# EAGLE schematic mouse_shield (EAGLE 5.11)
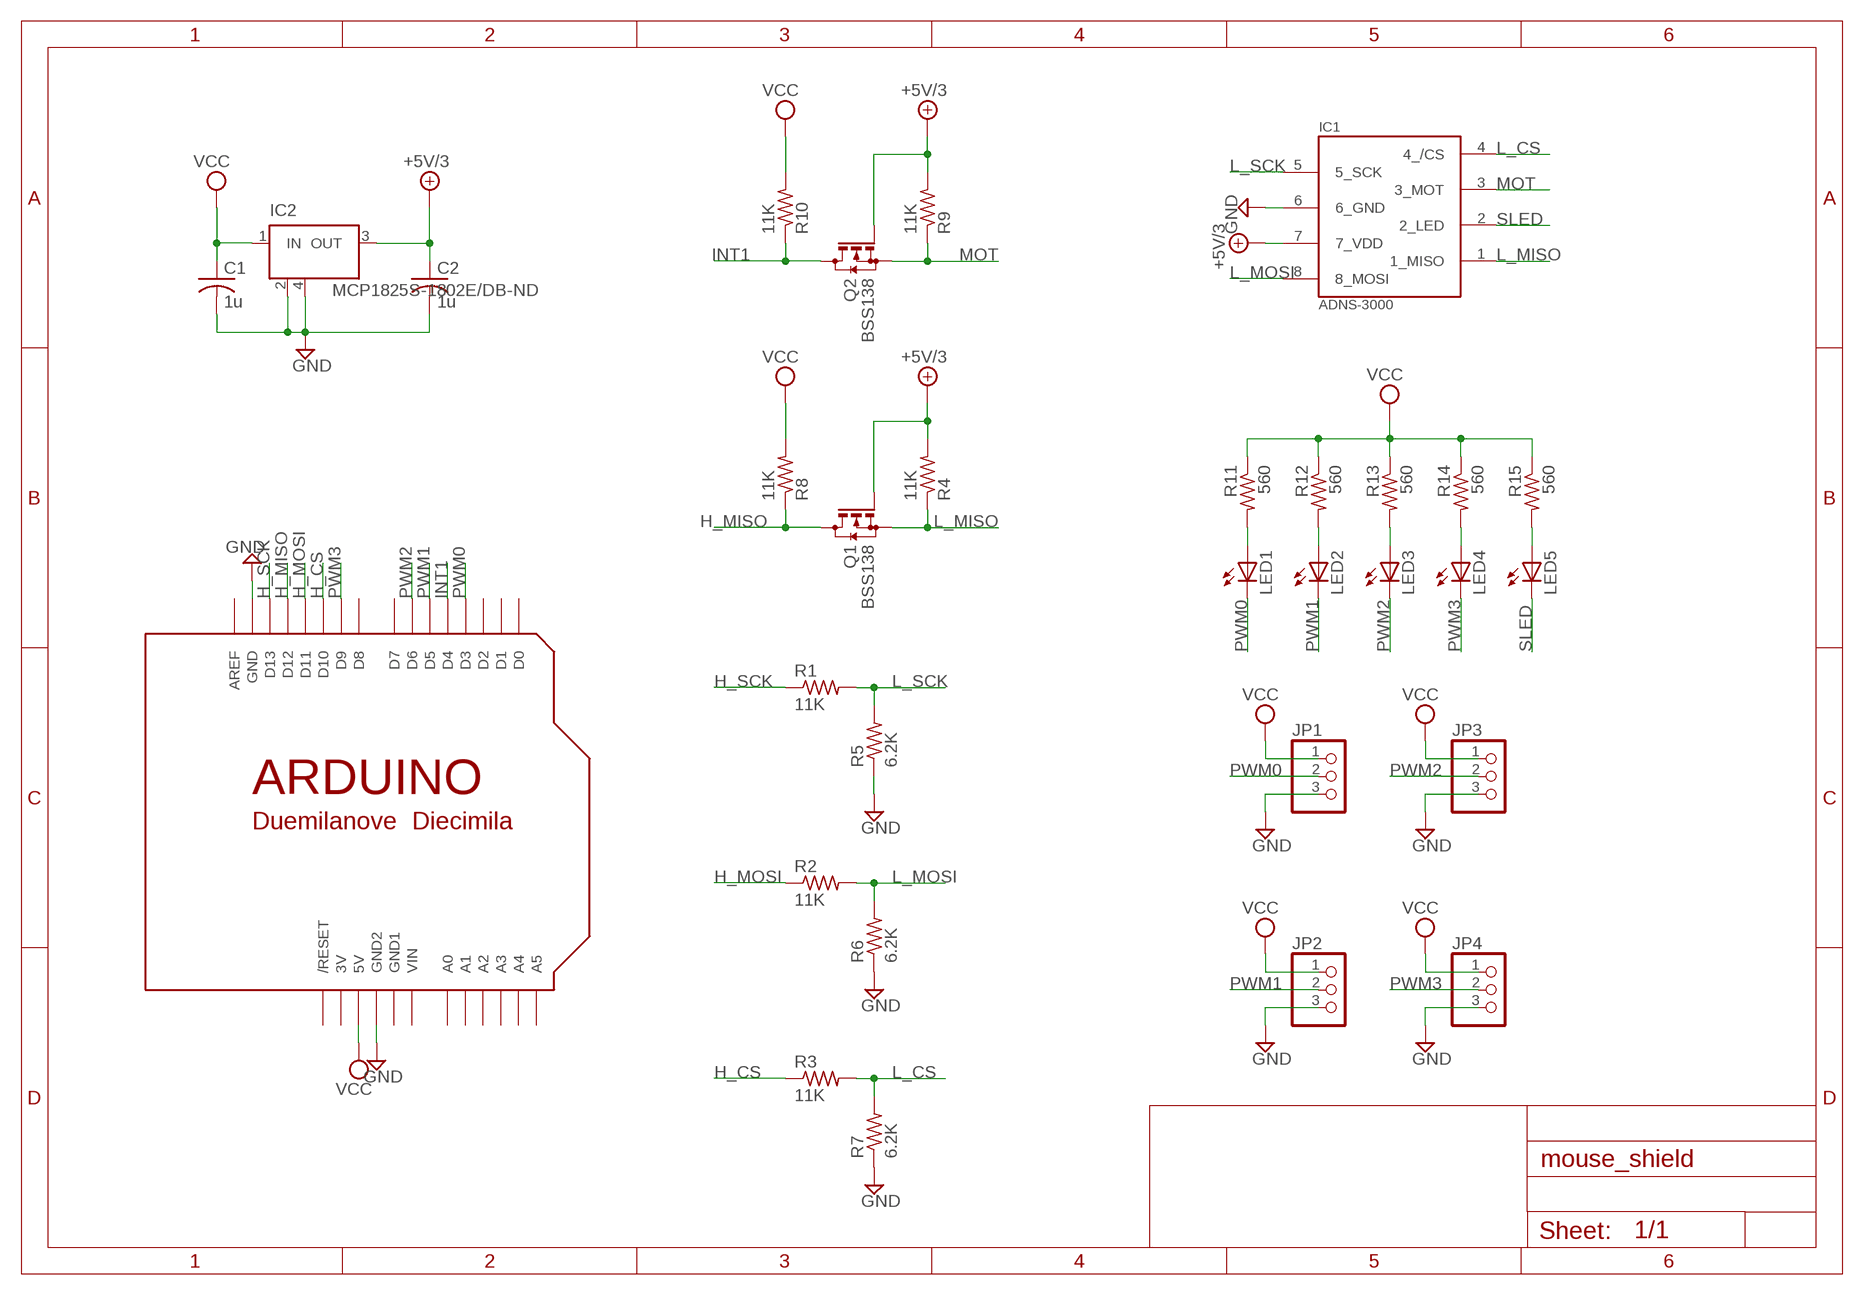
[diagram p0: schematic, sheet 1]

## Parts
C1  1u  C-USC1206  [C1206]
C2  1u  C-USC1206  [C1206]
IC1  ADNS-3000  [ADNS-3000]
IC2  MCP1825S-1802E/DB-ND  LM340S  [SOT223]
JP1  PINHD-1X3/90  [1X03/90]
JP2  PINHD-1X3/90  [1X03/90]
JP3  PINHD-1X3/90  [1X03/90]
JP4  PINHD-1X3/90  [1X03/90]
LED1  LEDCHIPLED_1206  [CHIPLED_1206]
LED2  LEDCHIPLED_1206  [CHIPLED_1206]
LED3  LEDCHIPLED_1206  [CHIPLED_1206]
LED4  LEDCHIPLED_1206  [CHIPLED_1206]
LED5  LEDCHIPLED_1206  [CHIPLED_1206]
Q1  BSS138  BSS123  [SOT23]
Q2  BSS138  BSS123  [SOT23]
R1  11K  R-US_R1206  [R1206]
R2  11K  R-US_R1206  [R1206]
R3  11K  R-US_R1206  [R1206]
R4  11K  R-US_R1206  [R1206]
R5  6.2K  R-US_R1206  [R1206]
R6  6.2K  R-US_R1206  [R1206]
R7  6.2K  R-US_R1206  [R1206]
R8  11K  R-US_R1206  [R1206]
R9  11K  R-US_R1206  [R1206]
R10  11K  R-US_R1206  [R1206]
R11  560  R-US_R1206  [R1206]
R12  560  R-US_R1206  [R1206]
R13  560  R-US_R1206  [R1206]
R14  560  R-US_R1206  [R1206]
R15  560  R-US_R1206  [R1206]
U$1  ARDUINO-NOHOLE  [ARDUINO-NOHOLE]

## Nets
+5V/3: C2.1 IC1.7(7_VDD) IC2.3(OUT) Q1.1(G) Q2.1(G) R4.2 R9.2
GND: C1.2 C2.2 IC1.6(6_GND) IC2.2(GND) IC2.4(GND) JP1.3 JP2.3 JP3.3 JP4.3 R5.1 R6.1 R7.1 U$1.GND U$1.GND2
H_CS: R3.1 U$1.D10
H_MISO: Q1.3(D) R8.1 U$1.D12
H_MOSI: R2.1 U$1.D11
H_SCK: R1.1 U$1.D13
INT1: Q2.3(D) R10.1 U$1.D4
L_CS: IC1.4(4_/CS) R3.2 R7.2
L_MISO: IC1.1(1_MISO) Q1.2(S) R4.1
L_MOSI: IC1.8(8_MOSI) R2.2 R6.2
L_SCK: IC1.5(5_SCK) R1.2 R5.2
MOT: IC1.3(3_MOT) Q2.2(S) R9.1
N$1: LED5.A R15.2
N$2: LED4.A R14.2
N$3: LED3.A R13.2
N$4: LED2.A R12.2
N$5: LED1.A R11.2
PWM0: JP1.2 LED1.C U$1.D3
PWM1: JP2.2 LED2.C U$1.D5
PWM2: JP3.2 LED3.C U$1.D6
PWM3: JP4.2 LED4.C U$1.D9
SLED: IC1.2(2_LED) LED5.C
VCC: C1.1 IC2.1(IN) JP1.1 JP2.1 JP3.1 JP4.1 R8.2 R10.2 R11.1 R12.1 R13.1 R14.1 R15.1 U$1.5V
Unconnected: U$1.A0 U$1.A1 U$1.A2 U$1.A3 U$1.A4 U$1.A5 U$1.AREF U$1.D0 U$1.D1 U$1.D2 U$1.D7 U$1.D8 U$1.RESET(/RESET)

## Power pins joined to a net without a drawn wire
3V: U$1.3V
GND1: U$1.GND1
VIN: U$1.VIN

## Library data of the parts
C1 C2 = rcl:C-US: CAPACITOR, American symbol
IC1 = avago:ADNS-3000
IC2 = linear:LM340S: 3-Terminal Positive Regulators Source: http://cache.national.com/ds/LM/LM340.pdf
JP1-JP4 = pinhead:PINHD-1X3: PIN HEADER
LED1-LED5 = led:LED: LED OSRAM: - CHIPLED LG R971, LG N971, LY N971, LG Q971, LY Q971, LO R971, LY R971 LH N974, LH R974 LS Q976, LO Q976, LY Q976 LO Q996 - Hyper CHIPLED LW Q18S LB Q993, LB Q99A, LB R99A - SideLED LS A670, LO A670, LY A670, LG A670, LP A670 LB A673, LV A673, LT A673, LW A673 LH A674 LY A675 LS A676, LA A676, LO A676, LY A676, LW A676 LS A679, LY A679, LG A679 - Hyper Micro SIDELED® LS Y876, LA Y876, LO Y876, LY Y876 LT Y87S - SmartLED LW L88C, LW L88S LB L89C, LB L89S, LG L890 LS L89K, LO L89K, LY L89K LS L896, LA L896, LO L896, LY L896 - TOPLED LS T670, LO T670, LY T670, LG T670, LP T670 LSG T670, LSP T670, LSY T670, LOP T670, LYG T670 LG T671, LOG T671, LSG T671 LB T673, LV T673, LT T673, LW T673 LH T674 LS T676, LA T676, LO T676, LY T676, LB T676, LH T676, LSB T676, LW T676 LB T67C, LV T67C, LT T67C, LS T67K, LO T67K, LY T67K, LW E67C LS E67B, LA E67B, LO E67B, LY E67B, LB E67C, LV E67C, LT E67C LW T67C LS T679, LY T679, LG T679 LS T770, LO T770, LY T770, LG T770, LP T770 LB T773, LV T773, LT T773, LW T773 LH T774 LS E675, LA E675, LY E675, LS T675 LS T776, LA T776, LO T776, LY T776, LB T776 LHGB T686 LT T68C, LB T68C - Hyper Mini TOPLED® LB M676 - Mini TOPLED Santana® LG M470 LS M47K, LO M47K, LY M47K Source: http://www.osram.convergy.de LUXEON: - LUMILED® LXK2-PW12-R00, LXK2-PW12-S00, LXK2-PW14-U00, LXK2-PW14-V00 LXK2-PM12-R00, LXK2-PM12-S00, LXK2-PM14-U00 LXK2-PE12-Q00, LXK2-PE12-R00, LXK2-PE12-S00, LXK2-PE14-T00, LXK2-PE14-U00 LXK2-PB12-K00, LXK2-PB12-L00, LXK2-PB12-M00, LXK2-PB14-N00, LXK2-PB14-P00, LXK2-PB14-Q00 LXK2-PR12-L00, LXK2-PR12-M00, LXK2-PR14-Q00, LXK2-PR14-R00 LXK2-PD12-Q00, LXK2-PD12-R00, LXK2-PD12-S00 LXK2-PH12-R00, LXK2-PH12-S00 LXK2-PL12-P00, LXK2-PL12-Q00, LXK2-PL12-R00 Source: www.luxeon.com KINGBRIGHT: KA-3528ASYC Source: www.kingbright.com
Q1 Q2 = transistor-small-signal:BSS123: N-CHANNEL MOS FET
R1-R15 = rcl:R-US_: RESISTOR, American symbol
U$1 = adafruit:ARDUINO: Arduino Diecimila/Duemilanove Make a shield with ease, this package has all the named pins as well as the two mounting drill holes and an outline of the USB and DC power connector. The outline is on the DIMENSION layer, so if your board house uses it they will cut the outline to match. http://www.ladyada.net/library/pcb/eaglelibrary.html